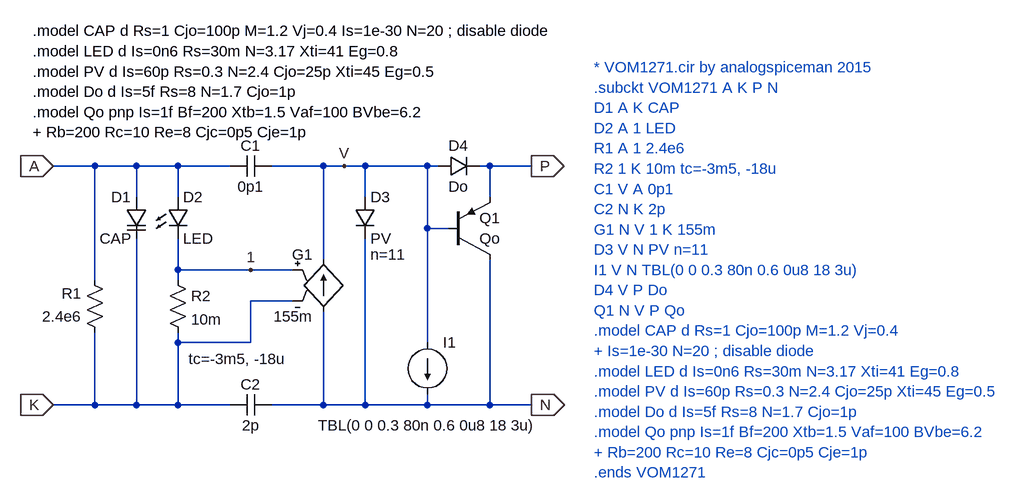
[diagram p0: schematic VOM1271.asc]
VOM1271.asc, the LTspice schematic file:
Version 4
SHEET 1 2008 680
WIRE 128 80 64 80
WIRE 192 80 128 80
WIRE 256 80 192 80
WIRE 336 80 256 80
WIRE 480 80 400 80
WIRE 512 80 480 80
WIRE 544 80 512 80
WIRE 640 80 544 80
WIRE 656 80 640 80
WIRE 736 80 720 80
WIRE 800 80 736 80
WIRE 192 128 192 80
WIRE 256 128 256 80
WIRE 544 128 544 80
WIRE 736 128 736 80
WIRE 640 176 640 80
WIRE 672 176 640 176
WIRE 480 224 480 80
WIRE 256 240 256 192
WIRE 368 240 256 240
WIRE 432 240 368 240
WIRE 128 256 128 80
WIRE 256 256 256 240
WIRE 432 288 368 288
WIRE 256 352 256 336
WIRE 368 352 368 288
WIRE 368 352 256 352
WIRE 640 352 640 176
WIRE 128 448 128 336
WIRE 128 448 64 448
WIRE 192 448 192 192
WIRE 192 448 128 448
WIRE 256 448 256 352
WIRE 256 448 192 448
WIRE 336 448 256 448
WIRE 480 448 480 304
WIRE 480 448 400 448
WIRE 544 448 544 192
WIRE 544 448 480 448
WIRE 640 448 640 432
WIRE 640 448 544 448
WIRE 736 448 736 224
WIRE 736 448 640 448
WIRE 800 448 736 448
FLAG 64 80 A
IOPIN 64 80 In
FLAG 64 448 K
IOPIN 64 448 In
FLAG 800 80 P
IOPIN 800 80 Out
FLAG 800 448 N
IOPIN 800 448 Out
FLAG 512 80 V
FLAG 368 240 1
SYMBOL res 144 352 R180
WINDOW 0 36 76 Left 2
WINDOW 3 36 40 Left 2
SYMATTR InstName R1
SYMATTR Value 2.4e6
SYMBOL varactor 208 128 M0
SYMATTR InstName D1
SYMATTR Value CAP
SYMATTR Type diode
SYMBOL LED 240 128 R0
SYMATTR InstName D2
SYMATTR Value LED
SYMATTR Description Diode
SYMATTR Type diode
SYMBOL res 240 240 R0
WINDOW 123 32 137 Left 2
SYMATTR Value2 tc=-3m5, -18u
SYMATTR InstName R2
SYMATTR Value 10m
SYMBOL cap 400 64 R90
WINDOW 0 0 32 VBottom 2
WINDOW 3 32 32 VTop 2
SYMATTR InstName C1
SYMATTR Value 0p1
SYMBOL cap 400 432 R90
WINDOW 0 0 32 VBottom 2
WINDOW 3 32 32 VTop 2
SYMATTR InstName C2
SYMATTR Value 2p
SYMBOL g 480 208 R0
WINDOW 0 -16 8 Right 2
WINDOW 3 -16 104 Right 2
SYMATTR InstName G1
SYMATTR Value 155m
SYMBOL diode 528 128 R0
WINDOW 123 24 88 Left 2
SYMATTR Value2 n=11
SYMATTR InstName D3
SYMATTR Value PV
SYMBOL current 640 352 R0
WINDOW 123 0 0 Left 2
WINDOW 39 0 0 Left 2
WINDOW 3 0 112 Top 2
SYMATTR Value TBL(0 0 0.3 80n 0.6 0u8 18 3u)
SYMATTR InstName I1
SYMBOL diode 656 96 R270
WINDOW 0 32 32 VTop 2
WINDOW 3 0 32 VBottom 2
SYMATTR InstName D4
SYMATTR Value Do
SYMBOL pnp 672 224 M180
WINDOW 0 48 64 Left 2
WINDOW 3 48 32 Left 2
SYMATTR InstName Q1
SYMATTR Value Qo
TEXT 32 -128 Left 2 !.model CAP d Rs=1 Cjo=100p M=1.2 Vj=0.4 Is=1e-30 N=20 ; disable diode\n.model LED d Is=0n6 Rs=30m N=3.17 Xti=41 Eg=0.8\n.model PV d Is=60p Rs=0.3 N=2.4 Cjo=25p Xti=45 Eg=0.5\n.model Do d Is=5f Rs=8 N=1.7 Cjo=1p\n.model Qo pnp Is=1f Bf=200 Xtb=1.5 Vaf=100 BVbe=6.2\n+ Rb=200 Rc=10 Re=8 Cjc=0p5 Cje=1p
TEXT 896 -72 Left 2 ;* VOM1271.cir by analogspiceman 2015\n.subckt VOM1271 A K P N\nD1 A K CAP\nD2 A 1 LED\nR1 A 1 2.4e6\nR2 1 K 10m tc=-3m5, -18u\nC1 V A 0p1\nC2 N K 2p\nG1 N V 1 K 155m\nD3 V N PV n=11\nI1 V N TBL(0 0 0.3 80n 0.6 0u8 18 3u)\nD4 V P Do\nQ1 N V P Qo\n.model CAP d Rs=1 Cjo=100p M=1.2 Vj=0.4\n+ Is=1e-30 N=20 ; disable diode\n.model LED d Is=0n6 Rs=30m N=3.17 Xti=41 Eg=0.8\n.model PV d Is=60p Rs=0.3 N=2.4 Cjo=25p Xti=45 Eg=0.5\n.model Do d Is=5f Rs=8 N=1.7 Cjo=1p\n.model Qo pnp Is=1f Bf=200 Xtb=1.5 Vaf=100 BVbe=6.2\n+ Rb=200 Rc=10 Re=8 Cjc=0p5 Cje=1p\n.ends VOM1271

The netlist it stands for:
* VOM1271.asc
R1 K A 2.4e6
D1 A K CAP
D2 A 1 LED
R2 1 K 10m tc=-3m5, -18u
C1 V A 0p1
C2 N K 2p
G1 N V 1 K 155m
D3 V N PV n=11
I1 V N TBL(0 0 0.3 80n 0.6 0u8 18 3u)
D4 V P Do
Q1 N V P 0 Qo
.model D D
.lib standard.dio
.model NPN NPN
.model PNP PNP
.lib standard.bjt
.model CAP d Rs=1 Cjo=100p M=1.2 Vj=0.4 Is=1e-30 N=20 ; disable diode
.model LED d Is=0n6 Rs=30m N=3.17 Xti=41 Eg=0.8
.model PV d Is=60p Rs=0.3 N=2.4 Cjo=25p Xti=45 Eg=0.5
.model Do d Is=5f Rs=8 N=1.7 Cjo=1p
.model Qo pnp Is=1f Bf=200 Xtb=1.5 Vaf=100 BVbe=6.2
+ Rb=200 Rc=10 Re=8 Cjc=0p5 Cje=1p
* * VOM1271.cir by analogspiceman 2015
* .subckt VOM1271 A K P N
* D1 A K CAP
* D2 A 1 LED
* R1 A 1 2.4e6
* R2 1 K 10m tc=-3m5, -18u
* C1 V A 0p1
* C2 N K 2p
* G1 N V 1 K 155m
* D3 V N PV n=11
* I1 V N TBL(0 0 0.3 80n 0.6 0u8 18 3u)
* D4 V P Do
* Q1 N V P Qo
* .model CAP d Rs=1 Cjo=100p M=1.2 Vj=0.4
* + Is=1e-30 N=20 ; disable diode
* .model LED d Is=0n6 Rs=30m N=3.17 Xti=41 Eg=0.8
* .model PV d Is=60p Rs=0.3 N=2.4 Cjo=25p Xti=45 Eg=0.5
* .model Do d Is=5f Rs=8 N=1.7 Cjo=1p
* .model Qo pnp Is=1f Bf=200 Xtb=1.5 Vaf=100 BVbe=6.2
* + Rb=200 Rc=10 Re=8 Cjc=0p5 Cje=1p
* .ends VOM1271
.backanno
.end